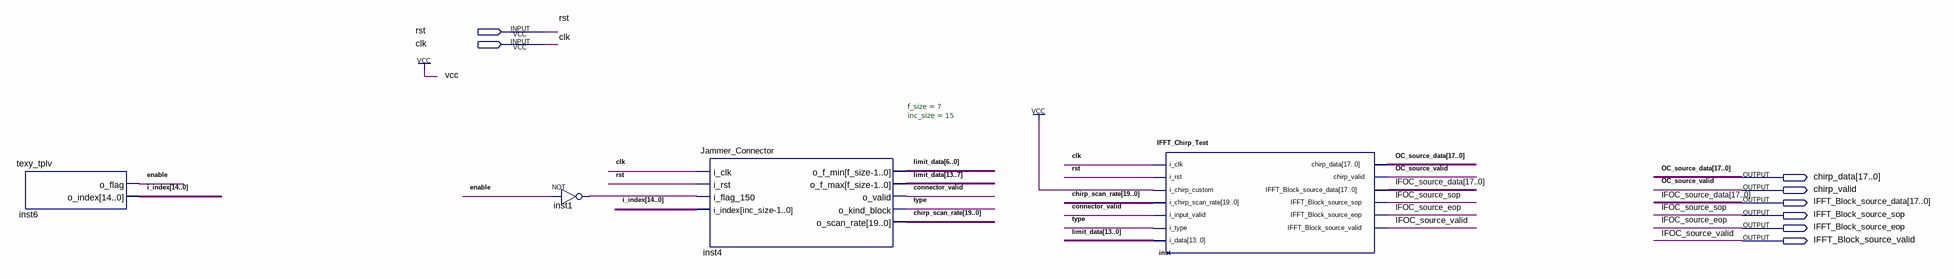
[diagram p0: schematic sheet]
// Quartus schematic Tplv_comp.bdf as structural Verilog: 4 symbols, 8 pins
module Tplv_comp (
  input  rst,
  input  clk,
  output [17:0] chirp_data,
  output chirp_valid,
  output [17:0] IFFT_Block_source_data,
  output IFFT_Block_source_sop,
  output IFFT_Block_source_eop,
  output IFFT_Block_source_valid
);

  wire connector_valid, enable, inst1_out, \type ;
  wire [13:0] limit_data;
  wire [14:0] i_index;
  wire [19:0] chirp_scan_rate;

  texy_tplv inst6 (.o_flag(enable), .o_index(i_index));
  not inst1 (inst1_out, enable);
  Jammer_Connector #(.f_size(7), .inc_size(15)) inst4 (
    .i_clk(clk), .i_rst(rst), .i_flag_150(inst1_out), .i_index(i_index), .o_f_min(limit_data[6:0]),
    .o_f_max(limit_data[13:7]), .o_valid(connector_valid), .o_kind_block(\type ),
    .o_scan_rate(chirp_scan_rate));
  IFFT_Chirp_Test inst (
    .i_clk(clk), .i_rst(rst), .i_chirp_custom(1'b1), .i_chirp_scan_rate(chirp_scan_rate),
    .i_input_valid(connector_valid), .i_type(\type ), .i_data(limit_data), .chirp_data(chirp_data),
    .chirp_valid(chirp_valid), .IFFT_Block_source_data(IFFT_Block_source_data),
    .IFFT_Block_source_sop(IFFT_Block_source_sop), .IFFT_Block_source_eop(IFFT_Block_source_eop),
    .IFFT_Block_source_valid(IFFT_Block_source_valid));

  // Other names for the same wires on the sheet: IFOC_source_data[17:0] = IFFT_Block_source_data;
  //   IFOC_source_eop = IFFT_Block_source_eop; IFOC_source_sop = IFFT_Block_source_sop;
  //   IFOC_source_valid = IFFT_Block_source_valid; OC_source_data[17:0] = chirp_data; OC_source_valid = chirp_valid
endmodule
